# Altium schematic sheet USB.SchDoc
size 420 x 297 mm; Scale: 1:1; DocumentType: Схема электрическая принципиальная; SheetNumber: 28; SheetTotal: 32; DocumentTypeShort: Э3; DocumentInvertoryNumber: ㅤ
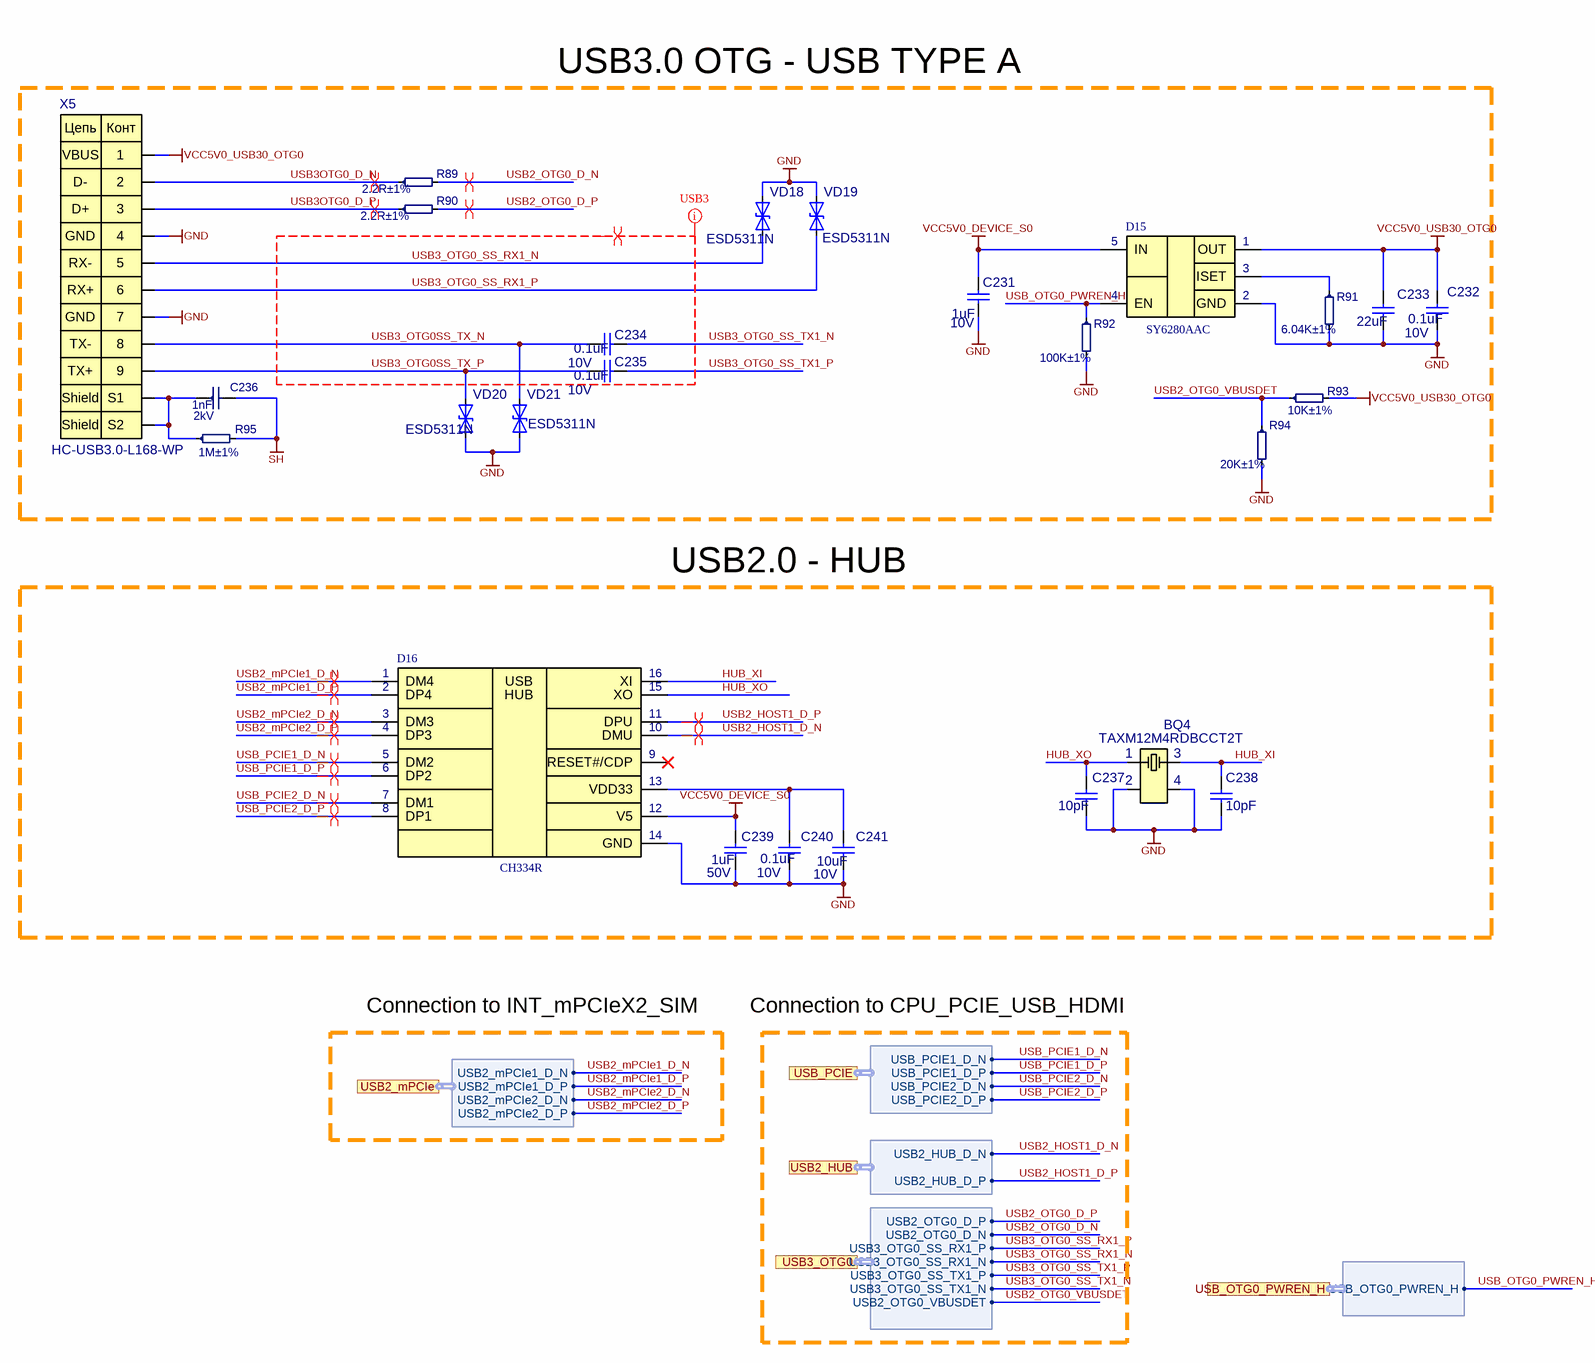
[diagram p0: USB.SchDoc]

## Parts
BQ4  TAXM12M4RDBCCT2T  [XC32M4-12.000-F10NNFT]
C231  1uF  Voltage: 10V  [C0402]
C232  0.1uF  Voltage: 10V  [C0402]
C233  22uF  [C0603]
C234  0.1uF  Voltage: 10V  [C0402]
C235  0.1uF  Voltage: 10V  [C0402]
C236  1nF  Voltage: 2kV  [C1812]
C237  10pF  [C0402]
C238  10pF  [C0402]
C239  1uF  Voltage: 50V  [C0603]
C240  0.1uF  Voltage: 10V  [C0402]
C241  10uF  Voltage: 10V  [C0402]
D15  SY6280AAC  [SY6280AAC]
D16  CH334R  [CH334R]
R89  2.2R±1%  [R0402]
R90  2.2R±1%  [R0402]
R91  6.04K±1%  [R0402]
R92  100K±1%  [R0402]
R93  10K±1%  [R0402]
R94  20K±1%  [R0402]
R95  1M±1%  [R1206]
VD18  ESD5311N  [ESD5311N]
VD19  ESD5311N  [ESD5311N]
VD20  ESD5311N  [ESD5311N]
VD21  ESD5311N  [ESD5311N]
X5  HC-USB3.0-L168-WP  [DS1095-05]

## Ports
USB2_HUB (harness USB2_HUB), USB2_mPCIe (harness USB2_mPCIe), USB3_OTG0 (harness USB3_OTG0), USB_OTG0_PWREN_H (harness USB_OTG0_PWREN_H), USB_PCIE (harness USB_PCIE)

## Harnesses
USB2_mPCIe: USB2_mPCIe1_D_P, USB2_mPCIe1_D_N, USB2_mPCIe2_D_P, USB2_mPCIe2_D_N
USB3_OTG0: USB3_OTG0_SS_RX1_P, USB3_OTG0_SS_RX1_N, USB3_OTG0_SS_TX1_P, USB2_OTG0_D_N, USB3_OTG0_SS_TX1_N, USB2_OTG0_VBUSDET, USB2_OTG0_D_P
USB2_HUB: USB2_HUB_D_P, USB2_HUB_D_N
USB_PCIE: USB_PCIE1_D_P, USB_PCIE1_D_N, USB_PCIE2_D_P, USB_PCIE2_D_N
USB_OTG0_PWREN_H: USB_OTG0_PWREN_H

## Nets
GND: BQ4.2 BQ4.4 C231.1 C232.2 C233.1 C237.1 C238.1 C239.1 C240.2 C241.1 D15.2(GND) D16.14(GND) R91.2 R92.2 R94.2 VD18.2 VD19.2 VD20.1 VD21.1 X5.4 X5.7
SH: C236.2 R95.2
VCC5V0_DEVICE_S0: C231.2 C239.2 D15.5(IN) D16.12(V5)
VCC5V0_USB30_OTG0: C232.1 C233.2 D15.1(OUT) R93.2 X5.1
HUB_XI: BQ4.3 C238.2 D16.16(XI)
HUB_XO: BQ4.1 C237.2 D16.15(XO)
USB2_HOST1_D_N: D16.10(DMU) ; port USB2_HUB.USB2_HUB_D_N
USB2_HOST1_D_P: D16.11(DPU) ; port USB2_HUB.USB2_HUB_D_P
USB2_mPCIe1_D_N: D16.1(DM4) ; port USB2_mPCIe.USB2_mPCIe1_D_N
USB2_mPCIe1_D_P: D16.2(DP4) ; port USB2_mPCIe.USB2_mPCIe1_D_P
USB2_mPCIe2_D_N: D16.3(DM3) ; port USB2_mPCIe.USB2_mPCIe2_D_N
USB2_mPCIe2_D_P: D16.4(DP3) ; port USB2_mPCIe.USB2_mPCIe2_D_P
USB2_OTG0_D_N: R89.2 ; port USB3_OTG0.USB2_OTG0_D_N
USB2_OTG0_D_P: R90.2 ; port USB3_OTG0.USB2_OTG0_D_P
USB2_OTG0_VBUSDET: R93.1 R94.1 ; port USB3_OTG0.USB2_OTG0_VBUSDET
USB3_OTG0_SS_RX1_N: VD18.1 X5.5 ; port USB3_OTG0.USB3_OTG0_SS_RX1_N
USB3_OTG0_SS_RX1_P: VD19.1 X5.6 ; port USB3_OTG0.USB3_OTG0_SS_RX1_P
USB3_OTG0_SS_TX1_N: C234.1 ; port USB3_OTG0.USB3_OTG0_SS_TX1_N
USB3_OTG0_SS_TX1_P: C235.1 ; port USB3_OTG0.USB3_OTG0_SS_TX1_P
USB3_OTG0SS_TX_N: C234.2 VD21.2 X5.8
USB3_OTG0SS_TX_P: C235.2 VD20.2 X5.9
USB3OTG0_D_N: R89.1 X5.2
USB3OTG0_D_P: R90.1 X5.3
USB_OTG0_PWREN_H: D15.4(EN) R92.1 ; port USB_OTG0_PWREN_H.USB_OTG0_PWREN_H
USB_PCIE1_D_N: D16.5(DM2) ; port USB_PCIE.USB_PCIE1_D_N
USB_PCIE1_D_P: D16.6(DP2) ; port USB_PCIE.USB_PCIE1_D_P
USB_PCIE2_D_N: D16.7(DM1) ; port USB_PCIE.USB_PCIE2_D_N
USB_PCIE2_D_P: D16.8(DP1) ; port USB_PCIE.USB_PCIE2_D_P
NetC236_1: C236.1 R95.1 X5.S1 X5.S2
NetC240_1: C240.1 C241.2 D16.13(VDD33)
NetD15_3: D15.3(ISET) R91.1

Not connected (* = marked no-connect by the designer): D16 9(RESET#/CDP)*

## Layout directives
net class USB3: USB3_OTG0_SS_RX1_N, USB3_OTG0_SS_RX1_P, USB3_OTG0SS_TX_N, USB3_OTG0SS_TX_P
differential pair; differential pair class Diff_Z90: USB2_HOST1_D_N, USB2_HOST1_D_P, USB2_mPCIe1_D_N, USB2_mPCIe1_D_P, USB2_mPCIe2_D_N, USB2_mPCIe2_D_P, USB2_OTG0_D_N, USB2_OTG0_D_P, USB3_OTG0_SS_RX1_N, USB3_OTG0_SS_RX1_P, USB3_OTG0SS_TX_N, USB3_OTG0SS_TX_P, USB3OTG0_D_N, USB3OTG0_D_P, USB_PCIE1_D_N, USB_PCIE1_D_P, USB_PCIE2_D_N, USB_PCIE2_D_P

## Notes on the sheet
- USB3.0 OTG - USB TYPE A
- (near X5) VBUS
- D-
- D+
- (near X5) GND
- (near X5) RX-
- (near X5) RX+
- (near X5) TX-
- (near X5) TX+
- USB2.0 - HUB
- Connection to INT_mPCIeX2_SIM
- Connection to CPU_PCIE_USB_HDMI
- Подп. и дата
- Инв. № дубл.
- Взам. инв. №
- Инв. № подл.
- Изм.
- Лист
- № докум.
- Подп.
- Дата
- Копировал
- Формат А3
- (in symbol CH334R) USB; HUB
- (in symbol DS1095-05) Цепь; Конт; Shield

## Library data of the parts
BQ4 = XC32M4-12.000-F10NNFT: 12MHz 10pF ±10ppm SMD3225-4P; Manufacturer: TAE; Check: False; Part Number: TAXM12M4RDBCCT2T; Value: TAXM12M4RDBCCT2T; NameFromManufacturer: TAXM12M4RDBCCT2T
C231 = 0402-X5R-10V-1uF±10%: Manufacturer: Samsung; NameFromManufacturer: CL05A105KP5NNNC; Place: S; Tolerance: 10%; Check: False; Annotation: *; Param: *; Value: 1uF; Part Number: 0402-X5R-10V-1uF±10%; Temperature: -55°C~85°C; ComponentLink1Description: DATASHEET; ComponentLink1URL: https://datasheet.ciiva.com/15195/getdatasheetpartid-358390-15195630.pdf?src-supplier=Verical; Datasheet: #https://datasheet.ciiva.com/15195/getdatasheetpartid-358390-15195630.pdf?src-supplier=Verical#; Last changed: 04.04.2021; ClassName: MCU
C232 C234 C235 C240 = 0402-X7R-16V-0.1uF±10%: Part Number: 0402-X5R-10V-0.1uF±10%; Manufacturer: Yageo; NameFromManufacturer: CC0402KRX5R6BB104; Place: S; Tolerance: 10%; Check: False; Value: 0.1uF; Temperature: -55°C~125°C; ComponentLink2Description: Link to datasheet; ComponentLink1Description: DATASHEET; Last changed: 27.10.2022
C233 = 0603-X5R-10V-22uF±20%: *; Manufacturer: Samsung Electro-Mechanics; NameFromManufacturer: CL10A226MQ8NRNE; Place: S; Voltage: 10V; Tolerance: 20%; Check: False; Part Number: 0603-X5R-10V-22uF±20%; Value: 22uF; Temperature: -55°C~85°C; ComponentLink2Description: Link to datasheet; ComponentLink1Description: DATASHEET; ComponentLink2URL: https://www.lcsc.com/product-detail/Multilayer-Ceramic-Capacitors-MLCC-SMD-SMT_Samsung-Electro-Mechanics-CL10A226MQ8NRNE_C159801.html; ComponentLink1URL: Datasheets/capacitors/1810261912_Samsung-Electro-Mechanics-CL10A226MQ8NRNE_C159801.pdf#Datasheets/capacitors/1810261912_Samsung-Electro-Mechanics-CL10A226MQ8NRNE_C159801.pdf#; Last changed: 05.12.2022
C236 = 1812-C0G-2kV-1uF±10%: *; Part Number: 1812-C0G-2kV-1nF±10%; Manufacturer: FH; NameFromManufacturer: 1812B102K202NT; Dielectric: C0G; Place: *); Tolerance: 5%; Check: False; Case: CASE; Value: 1nF; Temperature: -55°C~125°C; ComponentLink2Description: Link to datasheet; ComponentLink1Description: DATASHEET; ComponentLink2URL: https://octopart.com/1812ga102jat2a-avx-75165070?r=sp; ComponentLink1URL: Datasheets/capacitors/C0GNP0-Dielectric.pdf; Last changed: 27.10.2022
C237 C238 = 0402-NP0-50V-10pF±5%: Manufacturer: Yageo; NameFromManufacturer: CC0402JRNPO9BN100; Place: S; Voltage: 50V; Tolerance: 5%; Check: False; Part Number: 0402-NP0-50V-10pF±5%; Value: 10pF; Temperature: -55°C~125°C; ComponentLink2Description: Link to datasheet; ComponentLink1Description: DATASHEET; ComponentLink2URL: https://www.terraelectronica.ru/pdf/show?pdf_file=%252Fds%252Fpdf%252FN%252Fnpo.pdf; ComponentLink1URL: Datasheets/capacitors/DOC012565825.pdf; Last changed: 27.10.2022
C239 = 0603-X5R-50V-1uF±10%: *; Manufacturer: Yageo; NameFromManufacturer: CC0603KRX5R9BB105; Place: S; Tolerance: 10%; Analog: GRM188R61H105KAALD; Check: False; Part Number: 0603-X5R-50V-1uF±10%; Value: 1uF; Temperature: -55°C~85°C; ComponentLink2Description: Link to datasheet; ComponentLink1Description: DATASHEET; ComponentLink2URL: https://ru.mouser.com/ProductDetail/YAGEO/CC0603KRX5R9BB105?qs=zEY9bCHj09dqHVk4sHIcjA%3D%3D; ComponentLink1URL: Datasheets/capacitors/UPY-GPHC_X5R_4V-to-50V_26.pdf; Last changed: 27.10.2022
C241 = 0402-X5R-10V-10uF±20%: *; Manufacturer: Murata Electronics; NameFromManufacturer: GRM155R61A106ME44; Place: S; Tolerance: 20%; Check: False; Part Number: 0402-X5R-10V-10uF±20%; Value: 10uF; Temperature: -55°C~85°C; ComponentLink2Description: Link to datasheet; ComponentLink1Description: DATASHEET; ComponentLink2URL: https://octopart.com/grm155r61a106me44d-murata-99357754?r=sp; ComponentLink1URL: Datasheets/capacitors/GRM155R61A106ME44D.pdf; Last changed: 27.10.2022
D15 = SY6280AAC: Power Distribution Switches; Manufacturer: Silergy Corp; Check: False; Part Number: SY6280AAC; NameFromManufacturer: SY6280AAC; Value: SY6280AAC; ComponentLink1Description: DATASHEET; Last changed: 24.03.2023
D16 = CH334R: 4-port USB2.0 high-speed HUB controller; Manufacturer: WCH; Check: False; Part Number: CH334R; NameFromManufacturer: CH334R; Value: CH334R
R89 R90 = 0402-0.0625W-2.21K-100ppm±1%: *; Part Number: 0402-0.0625W-2.2R-100ppm±1%; NameFromManufacturer: RC0402FR-072R2L; Manufacturer: Yageo; Place: *); Value: 2.2R; Tolerance: 1%; Check: False; Case: R0402; Temperature: -55°C~155°C; ComponentLink1Description: DATASHEET; ComponentLink1URL: https://www.electronshik.ru/item/YAG/RC0402FR-072K21L; Datasheet: Datasheets/resistors/PYu-RC_Group_51_RoHS_L_12.pdf; Last changed: 27.10.2022
R91 = 0402-0.0625W-6.04K-100ppm±1%: NameFromManufacturer: RC0402FR-076K04L; Manufacturer: Yageo; Place: *); Value: 6.04K; Tolerance: 1%; Check: False; Case: R0402; Part Number: 0402-0.0625W-6.04K-100ppm±1%; Temperature: -55°C~155°C; ComponentLink1Description: DATASHEET; ComponentLink1URL: https://www.electronshik.ru/item/YAG/RC0402FR-076K04L; Datasheet: Datasheets/resistors/PYu-RC_Group_51_RoHS_L_11.pdf; Last changed: 18.11.2022
R92 = 0402-0.0625W-100K-100ppm±1%: Chip Resistor 0402 100kΩ ±1% 50V ±100ppm/℃ Thick Film; NameFromManufacturer: RC0402FR-07100KL; Manufacturer: Yageo; Place: *); Value: 100K; Check: False; Case: R0402; Part Number: 0402-0.0625W-100K-100ppm±1%; Tolerance: 1%; Temperature: -55°C~155°C; ComponentLink1Description: DATASHEET; ComponentLink1URL: https://www.yageo.com/upload/media/product/productsearch/datasheet/rchip/PYu-RC_Group_51_RoHS_L_11.pdf; Datasheet: Datasheets/resistors/PYu-RC_Group_51_RoHS_L_11.pdf; Last changed: 27.10.2022
R93 = 0402-0.0625W-10K-100ppm±1%: Chip Resistor 0402 10kΩ ±1% 50V ±100ppm/℃ Thick Film; NameFromManufacturer: RC0402FR-0710KL; Manufacturer: Yageo; Place: *); Value: 10K; Check: False; Case: R0402; Part Number: 0402-0.0625W-10K-100ppm±1%; Tolerance: 1%; Temperature: -55°C~155°C; ComponentLink1Description: DATASHEET; ComponentLink1URL: https://ru.mouser.com/ProductDetail/YAGEO/RC0402FR-0710KL?qs=%2Fha2pyFaduhjtLcYvKXQ8IogF7YwN7YtH%252BOO8ZtEEMnoa4yoWYcwpw%3D%3D; Datasheet: Datasheets/resistors/PYu-RC_Group_51_RoHS_L_11.pdf; Last changed: 27.10.2022
R94 = 0402-0.0625W-20K-100ppm±1%: Chip Resistor 0402 20kΩ ±1% 50V ±100ppm/℃ Thick Film; NameFromManufacturer: RC0402FR-0720KL; Manufacturer: Yageo; Place: *); Value: 20K; Check: False; Case: R0402; Part Number: 0402-0.0625W-20K-100ppm±1%; Tolerance: 1%; Temperature: -55°C~155°C; ComponentLink1Description: DATASHEET; ComponentLink1URL: https://www.terraelectronica.ru/product/506449; Datasheet: Datasheets/resistors/PYu-RC_Group_51_RoHS_L_11.pdf; Last changed: 27.10.2022
R95 = 1206-0.25W-1M-100ppm±1%: Chip Resistor 1206 1MΩ ±1% 200V ±100ppm/℃ Thick Film; NameFromManufacturer: RC1206FR-071ML; Manufacturer: Yageo; Place: *); Value: 1M; Check: False; Case: R1206; Part Number: 1206-0.25W-1M-100ppm±1%; Tolerance: 1%; Temperature: -55°C~155°C; ComponentLink1Description: DATASHEET; ComponentLink1URL: https://www.lcsc.com/product-detail/Chip-Resistor-Surface-Mount_YAGEO-RC1206FR-071ML_C108083.html?s_z=n_RC1206FR-071ML; Last changed: 09.04.2025
VD18-VD21 = ESD5311N: 1-Line, Bi-directional, Transient Voltage Suppressors.0.25pF.; Manufacturer: UMW; Check: False; Part Number: ESD5311N; Value: ESD5311N; NameFromManufacturer: ESD5311N
X5 = DS1095-05: USB type A, USB 3.0, right angle; Manufacturer: Hong Cheng; Place: *); Check: False; Part Number: HC-USB3.0-L168-WP; Value: HC-USB3.0-L168-WP; Temperature: -40°C~85°C; ComponentLink1Description: DATASHEET; NameFromManufacturer: HC-USB3.0-L168-WP; ComponentLink1URL: https://www.chipdip.ru/product/usb-3.0-a-ds1095-05; Last changed: 27.10.2022